# Altium schematic sheet Top Sheet_Power System.SchDoc
size B; Organization: Altium Limited; Address1: L3, 12a Rodborough Rd; Address2: Frenchs Forest; Address3: NSW; Address4: Australia 2086; SheetNumber: 1; SheetTotal: 1
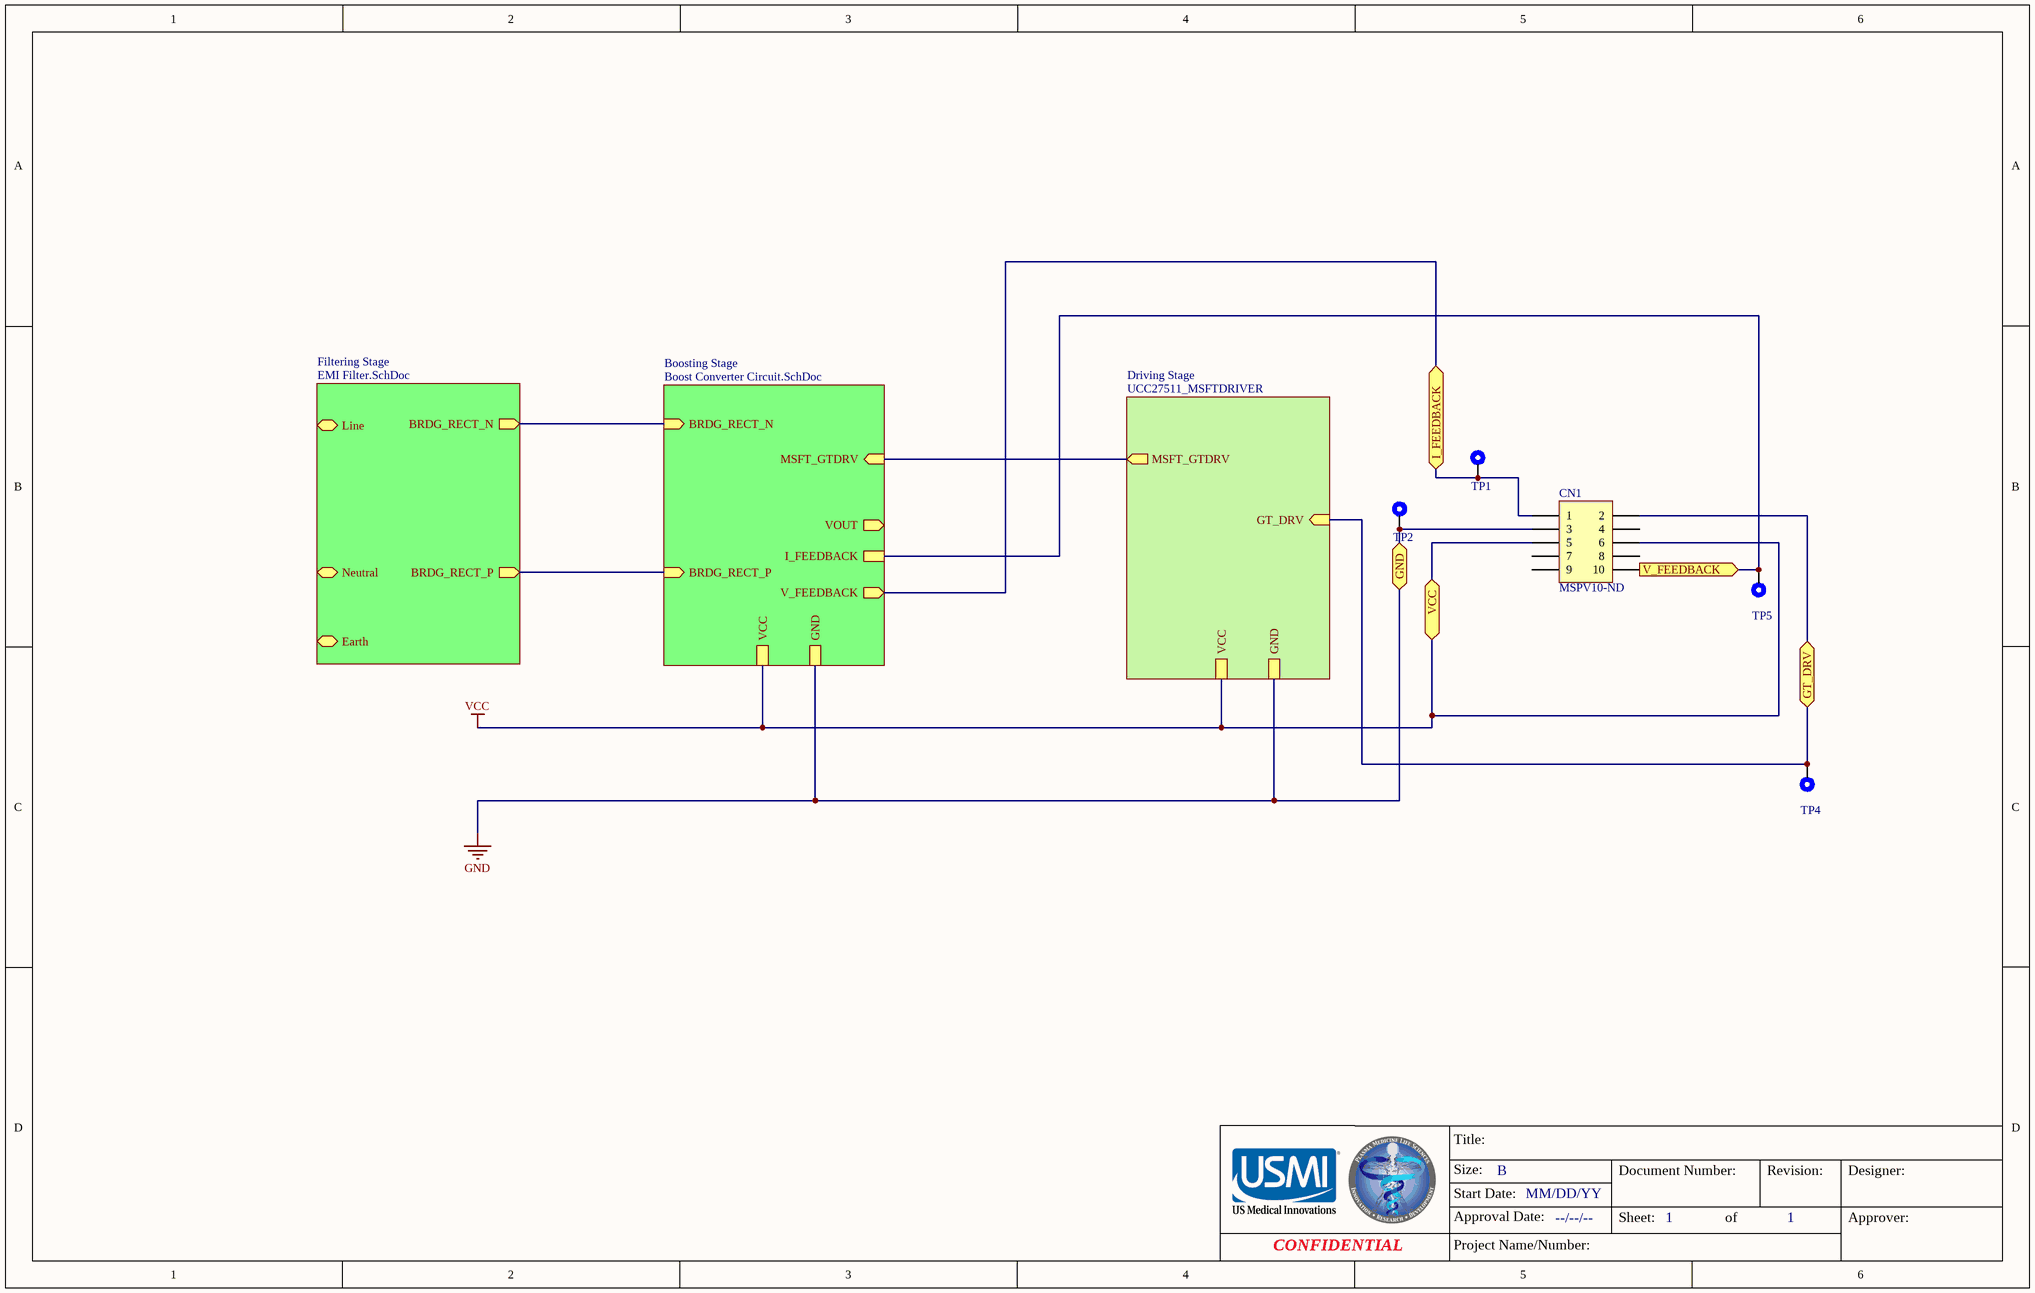
[diagram p0: Top Sheet_Power System.SchDoc]

## Parts
CN1  MSPV10-ND  [MSV10-ND]
TP1  5006  [Test Point]  (value not drawn)
TP2  5006  [Test Point]  (value not drawn)
TP4  5006  [Test Point]  (value not drawn)
TP5  5006  [Test Point]  (value not drawn)

## Sub-sheets
Boosting Stage = Boost Converter Circuit.SchDoc: BRDG_RECT_P (in), VOUT (out), MSFT_GTDRV (in), BRDG_RECT_N (in), V_FEEDBACK (out), I_FEEDBACK, VCC, GND
Driving Stage = UCC27511_MSFTDRIVER: MSFT_GTDRV (out), GT_DRV (in), GND, VCC
Filtering Stage = EMI Filter.SchDoc: BRDG_RECT_P (out), BRDG_RECT_N (out), Line (bidir), Neutral (bidir), Earth (bidir)

## Ports
GND, GT_DRV, I_FEEDBACK, V_FEEDBACK (in), VCC

## Nets
GND: CN1.3 TP2.1 ; port GND, sheet Driving Stage/GND, sheet Boosting Stage/GND
VCC: CN1.5 CN1.6 ; port VCC, sheet Driving Stage/VCC, sheet Boosting Stage/VCC
GT_DRV: CN1.2 TP4.1 ; port GT_DRV, sheet Driving Stage/GT_DRV
I_FEEDBACK: CN1.1 TP1.1 ; port I_FEEDBACK, sheet Boosting Stage/V_FEEDBACK
V_FEEDBACK: CN1.10 TP5.1 ; port V_FEEDBACK, sheet Boosting Stage/I_FEEDBACK
(unnamed): sheet Driving Stage/MSFT_GTDRV, sheet Boosting Stage/MSFT_GTDRV
(unnamed): sheet Filtering Stage/BRDG_RECT_P, sheet Boosting Stage/BRDG_RECT_P
(unnamed): sheet Filtering Stage/BRDG_RECT_N, sheet Boosting Stage/BRDG_RECT_N

Not connected (* = marked no-connect by the designer): CN1 4 7 8 9

## Notes on the sheet
- Title:
- Size:
- B
- Document Number:
- Revision:
- Designer:
- Approval Date:
- Start Date:
- MM/DD/YY
- --/--/--
- Sheet:
- of
- Approver:
- CONFIDENTIAL
- Project Name/Number:

## Library data of the parts
CN1 = MSPV10-ND: CONN SOCKET PCB VERT 10POS .1"; Manufacturer: 3M; Manufacturer Part Number: 8510-4500PL; Connector Type: Receptacle; Style: Board to Board or Cable; Number of Positions: 10; Number of Positions Loaded: All; Pitch - Mating: 0.100" (2.54mm); Contact Length - Post: 0.110" (2.79mm); Material Flammability Rating: UL94 V-0; Current Rating: 1A; Voltage Rating: 1000V; Supplier 1: Digi-Key; RoHS: RoHS Compliant; Category: Connectors, Interconnects; Stock 1: 448; Pricing 1: 1=3.03, 10=2.904, 100=2.42, 500=2.057, 1000=1.7545, 5000=1.573 (USD); Packaging: Bulk; Part Status: Active; Contact Type: Female Socket; Number of Rows: 2; Row Spacing - Mating: 0.100" (2.54mm); Mounting Type: Through Hole; Termination: Kinked Pin, Solder; Fastening Type: Push-Pull; Contact Finish - Mating: Gold; Contact Finish Thickness - Mating: 12µin (0.30µm); Insulation Color: Gray; Insulation Height: 0.425" (10.80mm); Operating Temperature: -55°C ~ 105°C; Contact Finish - Post: Gold; Mated Stacking Heights: -; Ingress Protection: -; Features: Polarizing Key; Applications: -; Insulation Material: Polybutylene Terephthalate (PBT), Glass Filled; Contact Shape: Square; Contact Material: Copper Alloy; Contact Finish Thickness - Post: Flash; ComponentLink1URL: http://multimedia.3m.com/mws/media/22252O/3mtm-100-in-plr-bmskt-100x-100ctrbmp-strt-sldr-tls-ts0413.pdf; ComponentLink1Description: http://multimedia.3m.com/mws/media/22252O/3mtm-100-in-plr-bmskt-100x-100ctrbmp-strt-sldr-tls-ts0413.pdf; Supplier Part Number 1: MSPV10-ND
TP1 TP2 TP4 TP5 = 5006: TEST POINT PC COMPACT .063"D BLK; Manufacturer 1: Keystone Electronics; Category 1: Test and Measurement; Plating: Silver; Material - Insulation: Nylon 46, UL 94V-0; Material - Body: Phosphor Bronze; Supplier 1: Digi-Key; Supplier Part Number 1: 36-5006-ND; Manufacturer Part Number 1: 5006; RoHS 1: RoHS Compliant; Description 1: TEST POINT PC COMPACT .063"D BLK; Stock 1: 199444; Pricing 1: 1=0.37, 10=0.316, 50=0.2298, 100=0.2209, 250=0.19832, 500=0.18932, 1000=0.1616, 2500=0.14424, 5000=0.13523 (USD); Packaging: Bulk; Part Status: Active; Type: PC Test Point, Compact; Mounting Type: 0.063" (1.60mm) Hole Diameter; Color: Black; Size / Dimension: 0.125" Dia x 0.220" L (3.18mm x 5.59mm); ComponentLink1URL: http://www.keyelco.com/product-pdf.cfm?p=1314; ComponentLink1Description: http://www.keyelco.com/product-pdf.cfm?p=1314